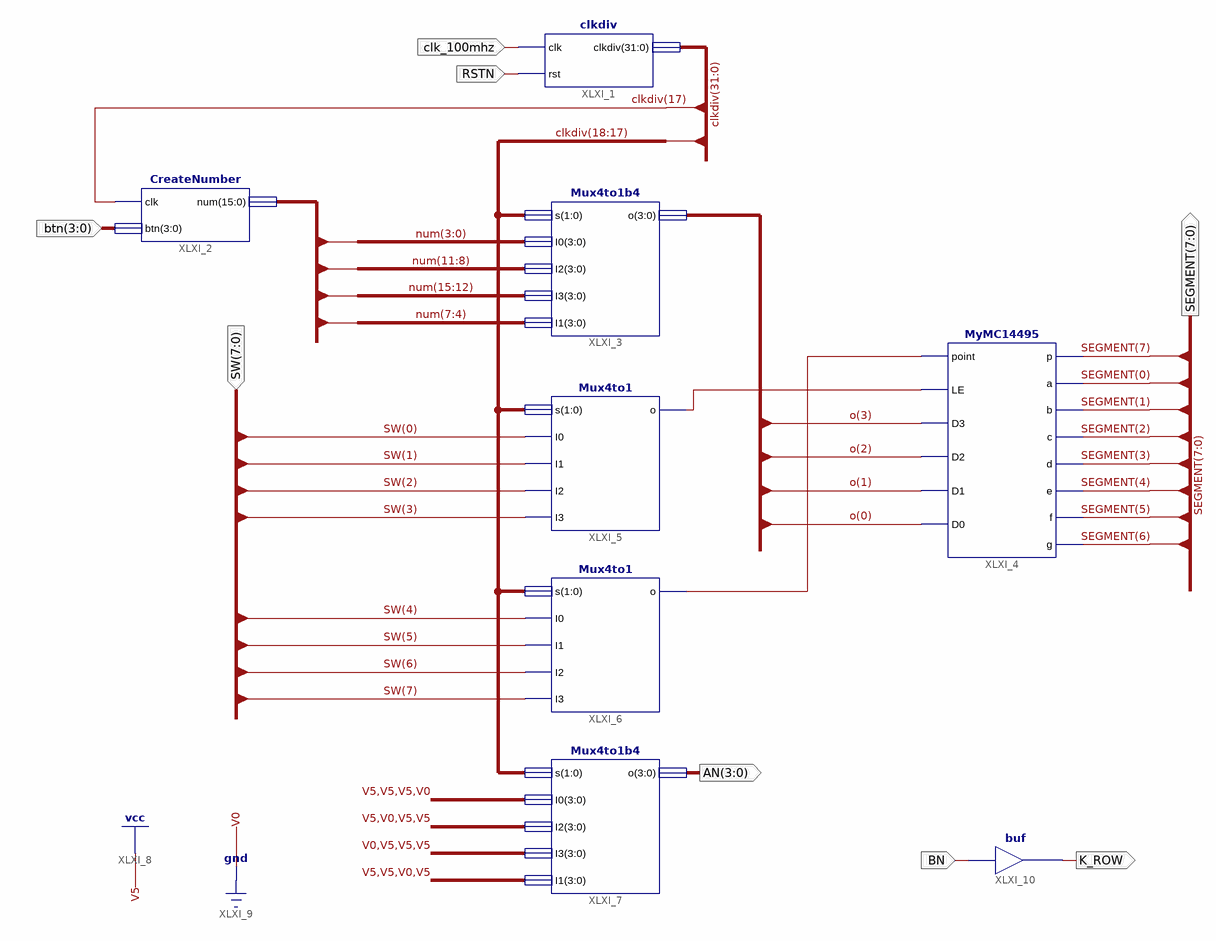
[diagram p0: schematic sheet 1]
// Xilinx ISE schematic ScoreBoard.sch (kintex7) as structural Verilog: 8 symbols, 8 ports
module ScoreBoard (
  input  clk_100mhz,
  input  RSTN,
  input  [3:0] btn,
  input  [7:0] SW,
  input  BN,
  output [3:0] AN,
  output [7:0] SEGMENT,
  output K_ROW
);

  wire XLXN_45, XLXN_46;
  wire [3:0] o;
  wire [15:0] num;
  wire [31:0] clkdiv;

  clkdiv XLXI_1 (.clk(clk_100mhz), .rst(RSTN), .clkdiv(clkdiv));
  CreateNumber XLXI_2 (.clk(clkdiv[17]), .btn(btn), .num(num));
  Mux4to1b4 XLXI_3 (.s(clkdiv[18:17]), .I0(num[3:0]), .I2(num[11:8]), .I3(num[15:12]), .I1(num[7:4]), .o(o));
  MyMC14495 XLXI_4 (
    .point(XLXN_45), .LE(XLXN_46), .D3(o[3]), .D2(o[2]), .D1(o[1]), .D0(o[0]), .p(SEGMENT[7]),
    .a(SEGMENT[0]), .b(SEGMENT[1]), .c(SEGMENT[2]), .d(SEGMENT[3]), .e(SEGMENT[4]), .f(SEGMENT[5]),
    .g(SEGMENT[6]));
  Mux4to1 XLXI_5 (.s(clkdiv[18:17]), .I0(SW[0]), .I1(SW[1]), .I2(SW[2]), .I3(SW[3]), .o(XLXN_46));
  Mux4to1 XLXI_6 (.s(clkdiv[18:17]), .I0(SW[4]), .I1(SW[5]), .I2(SW[6]), .I3(SW[7]), .o(XLXN_45));
  Mux4to1b4 XLXI_7 (.s(clkdiv[18:17]), .I0(4'b1110), .I2(4'b1011), .I3(4'b0111), .I1(4'b1101), .o(AN));
  buf XLXI_10 (K_ROW, BN);
endmodule
